# EAGLE schematic AniBike_v2.7_BT_MainBoard (EAGLE 5.08)

## Sheet 1 of 2
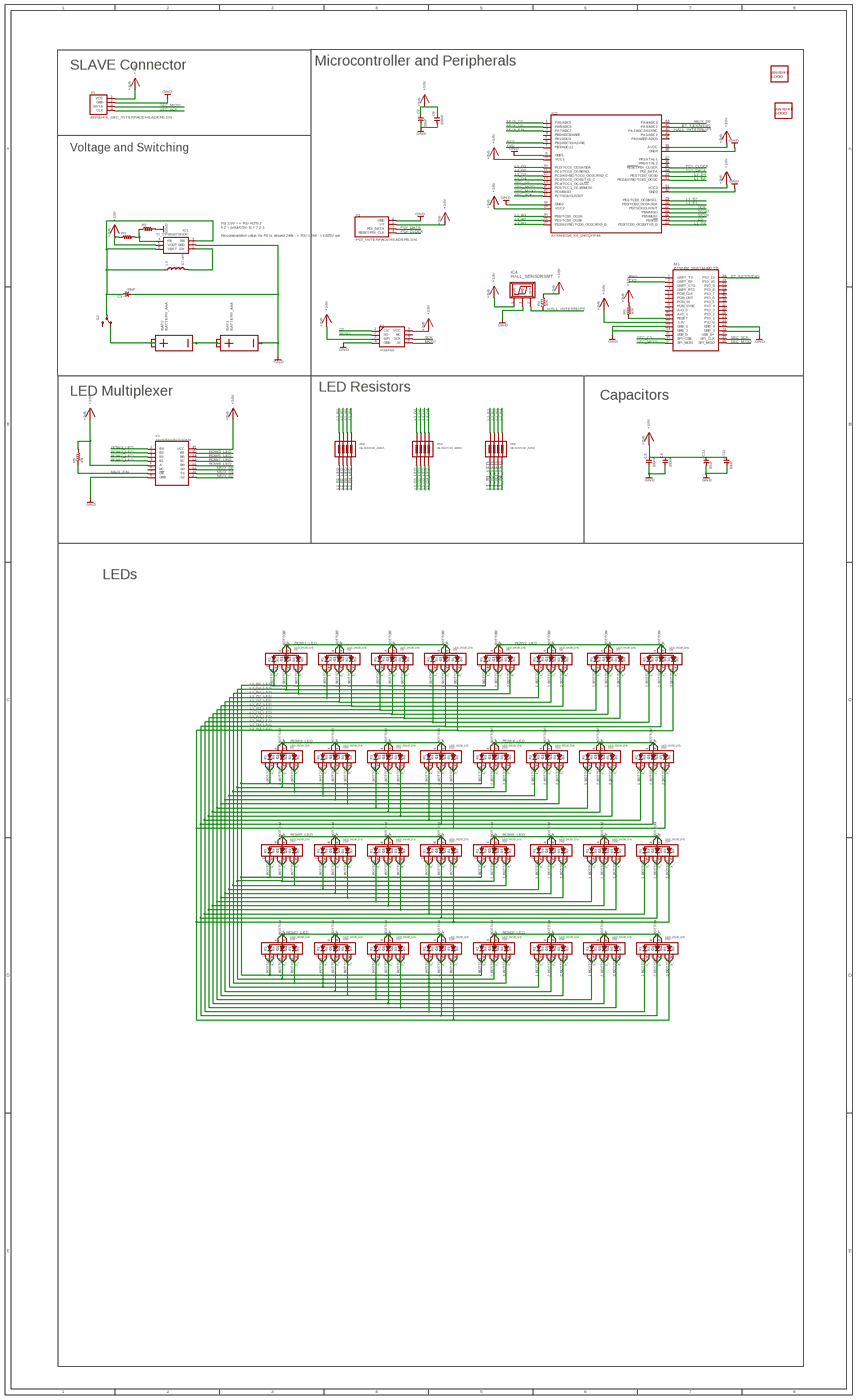
[diagram p0: schematic, sheet 1, overview]
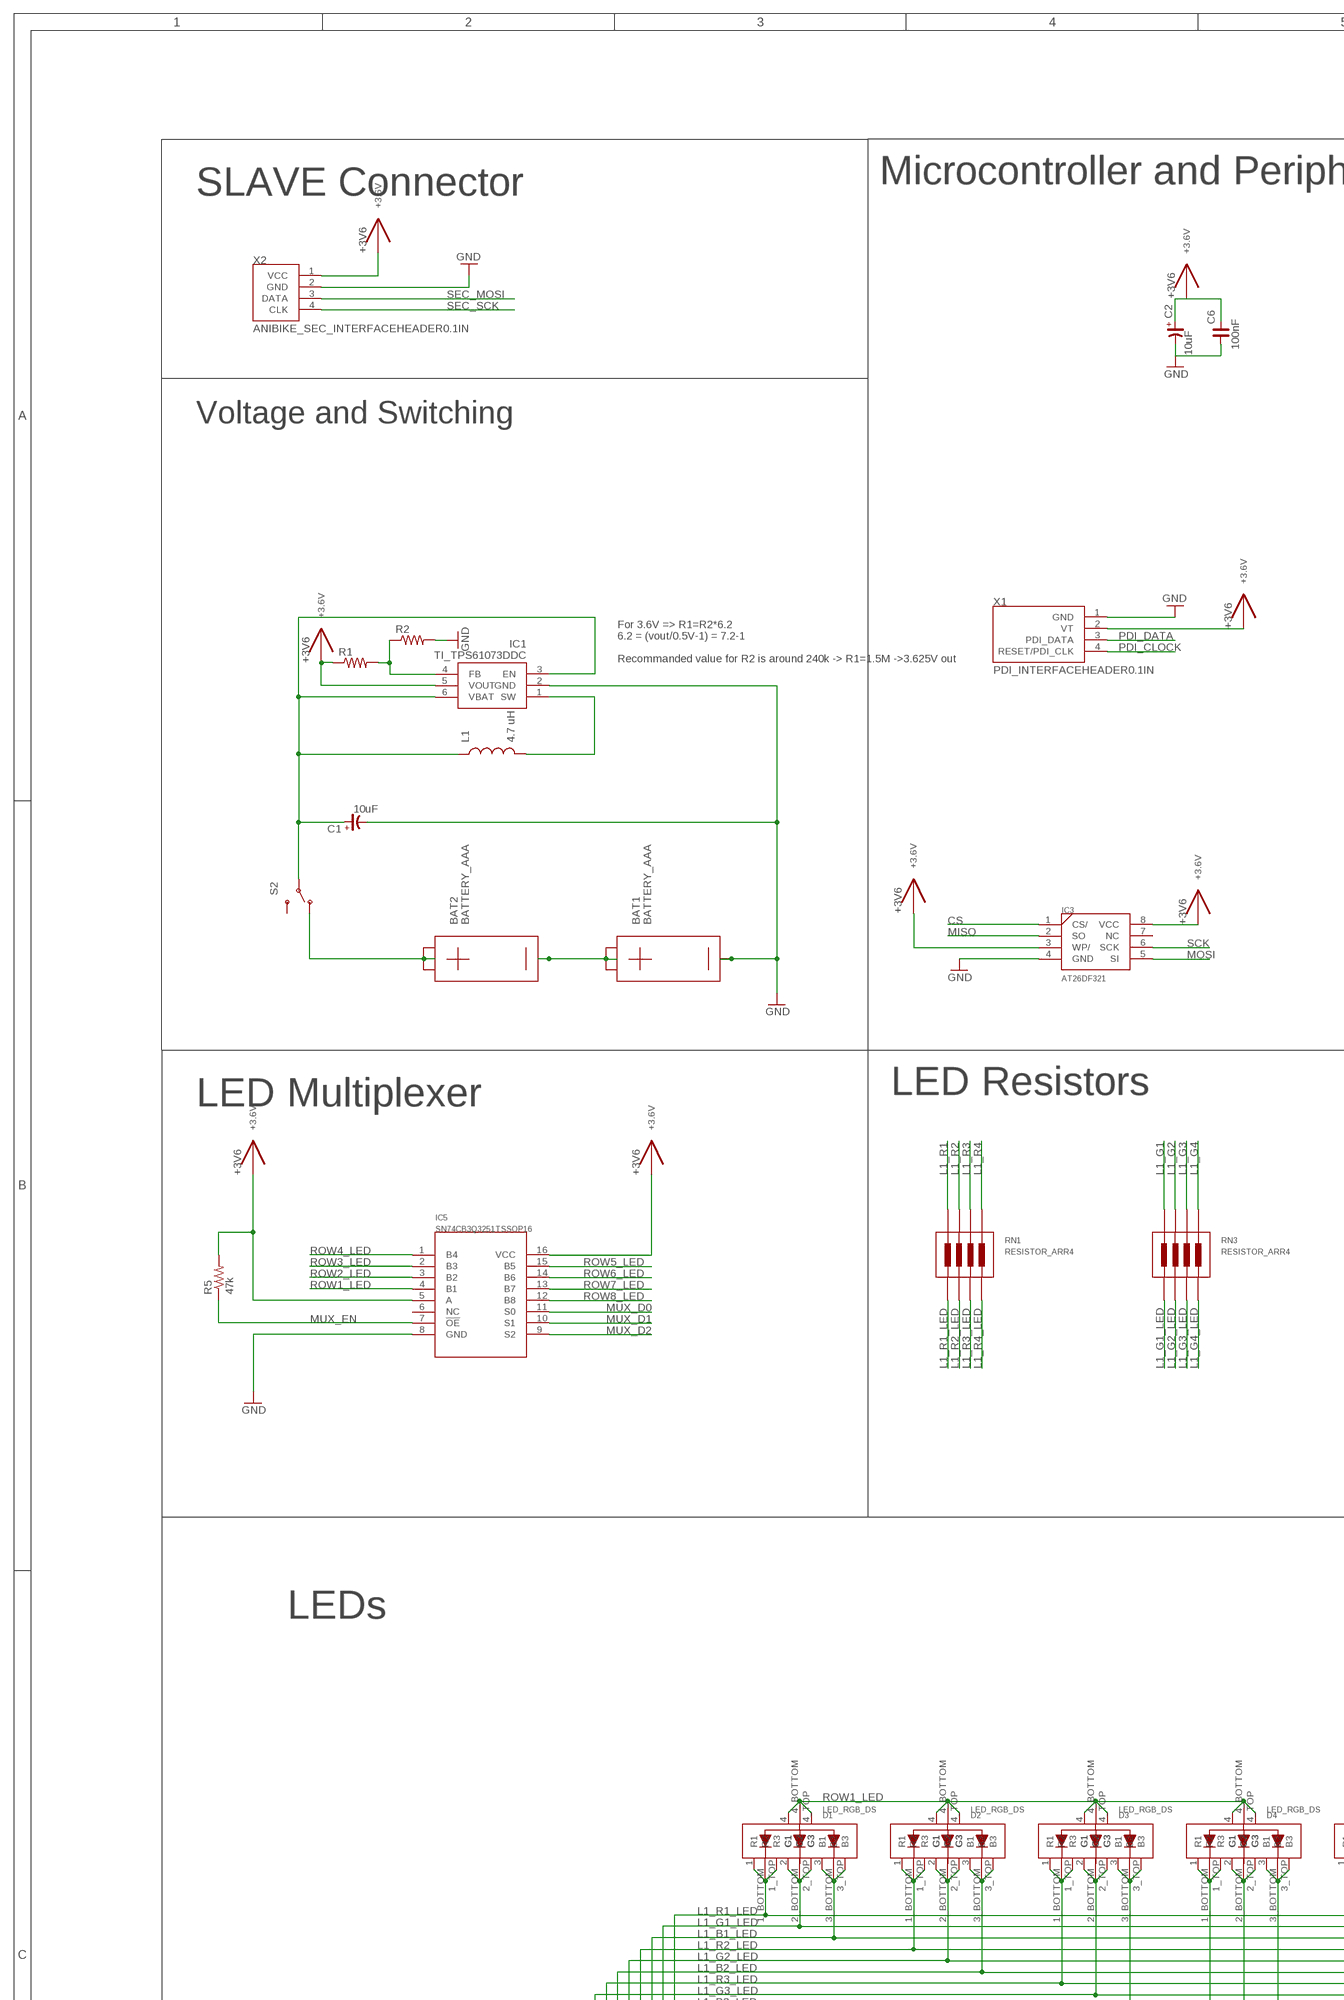
[diagram p1: schematic, sheet 1, part 1 of 4]
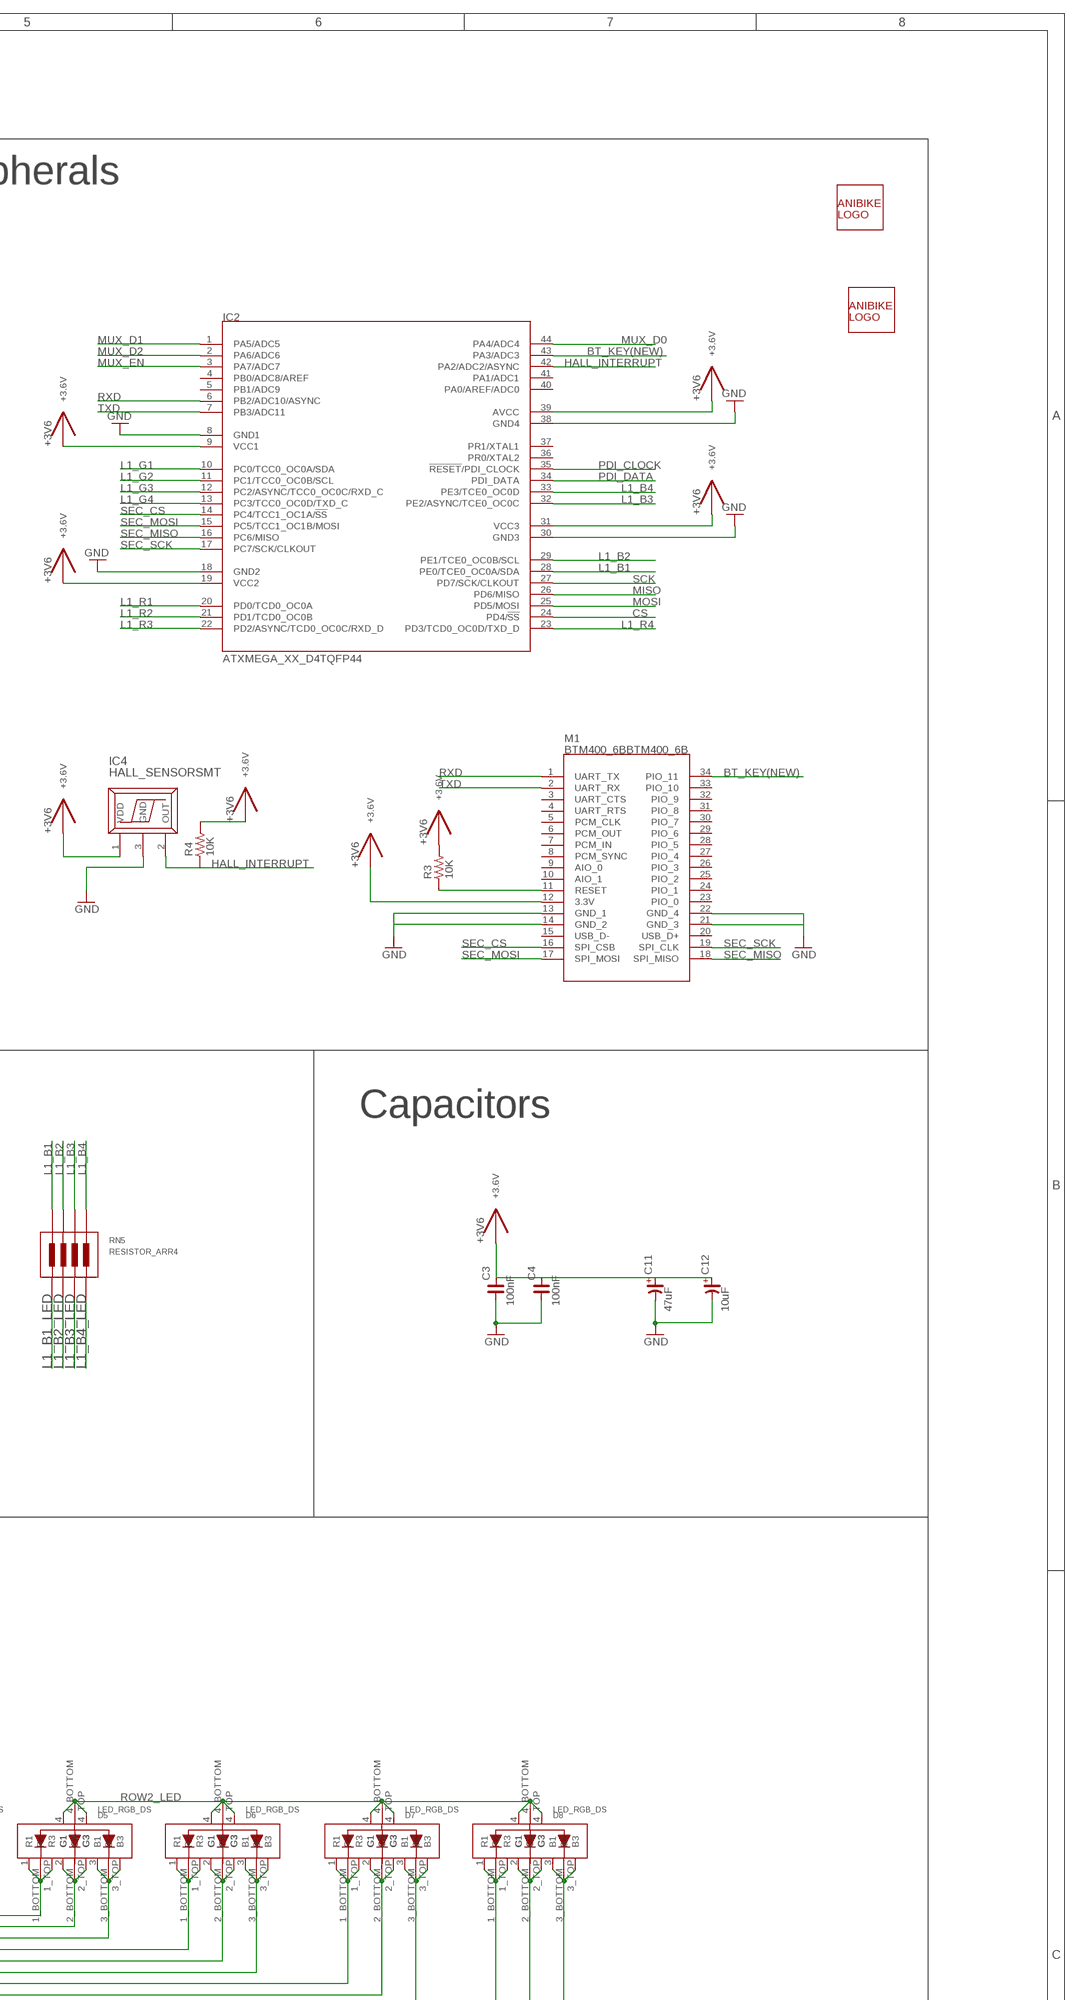
[diagram p2: schematic, sheet 1, part 2 of 4]
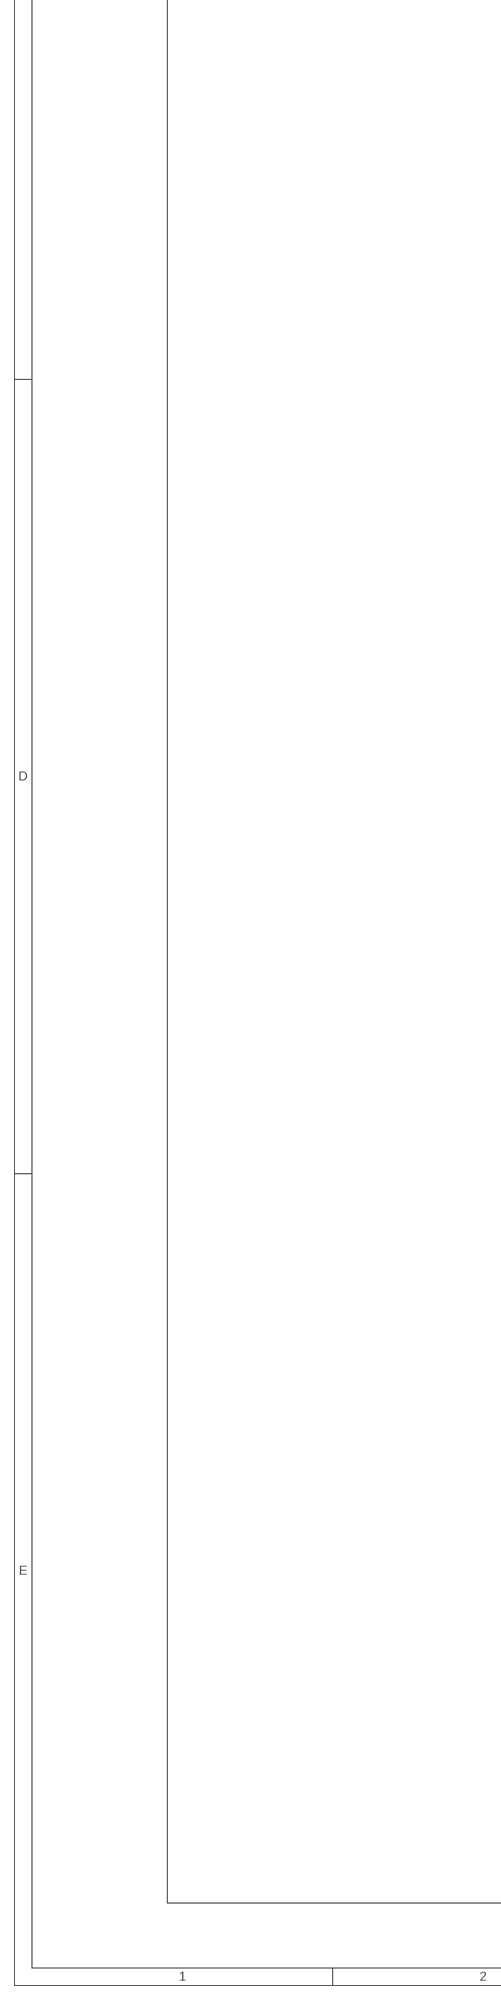
[diagram p3: schematic, sheet 1, part 3 of 4]
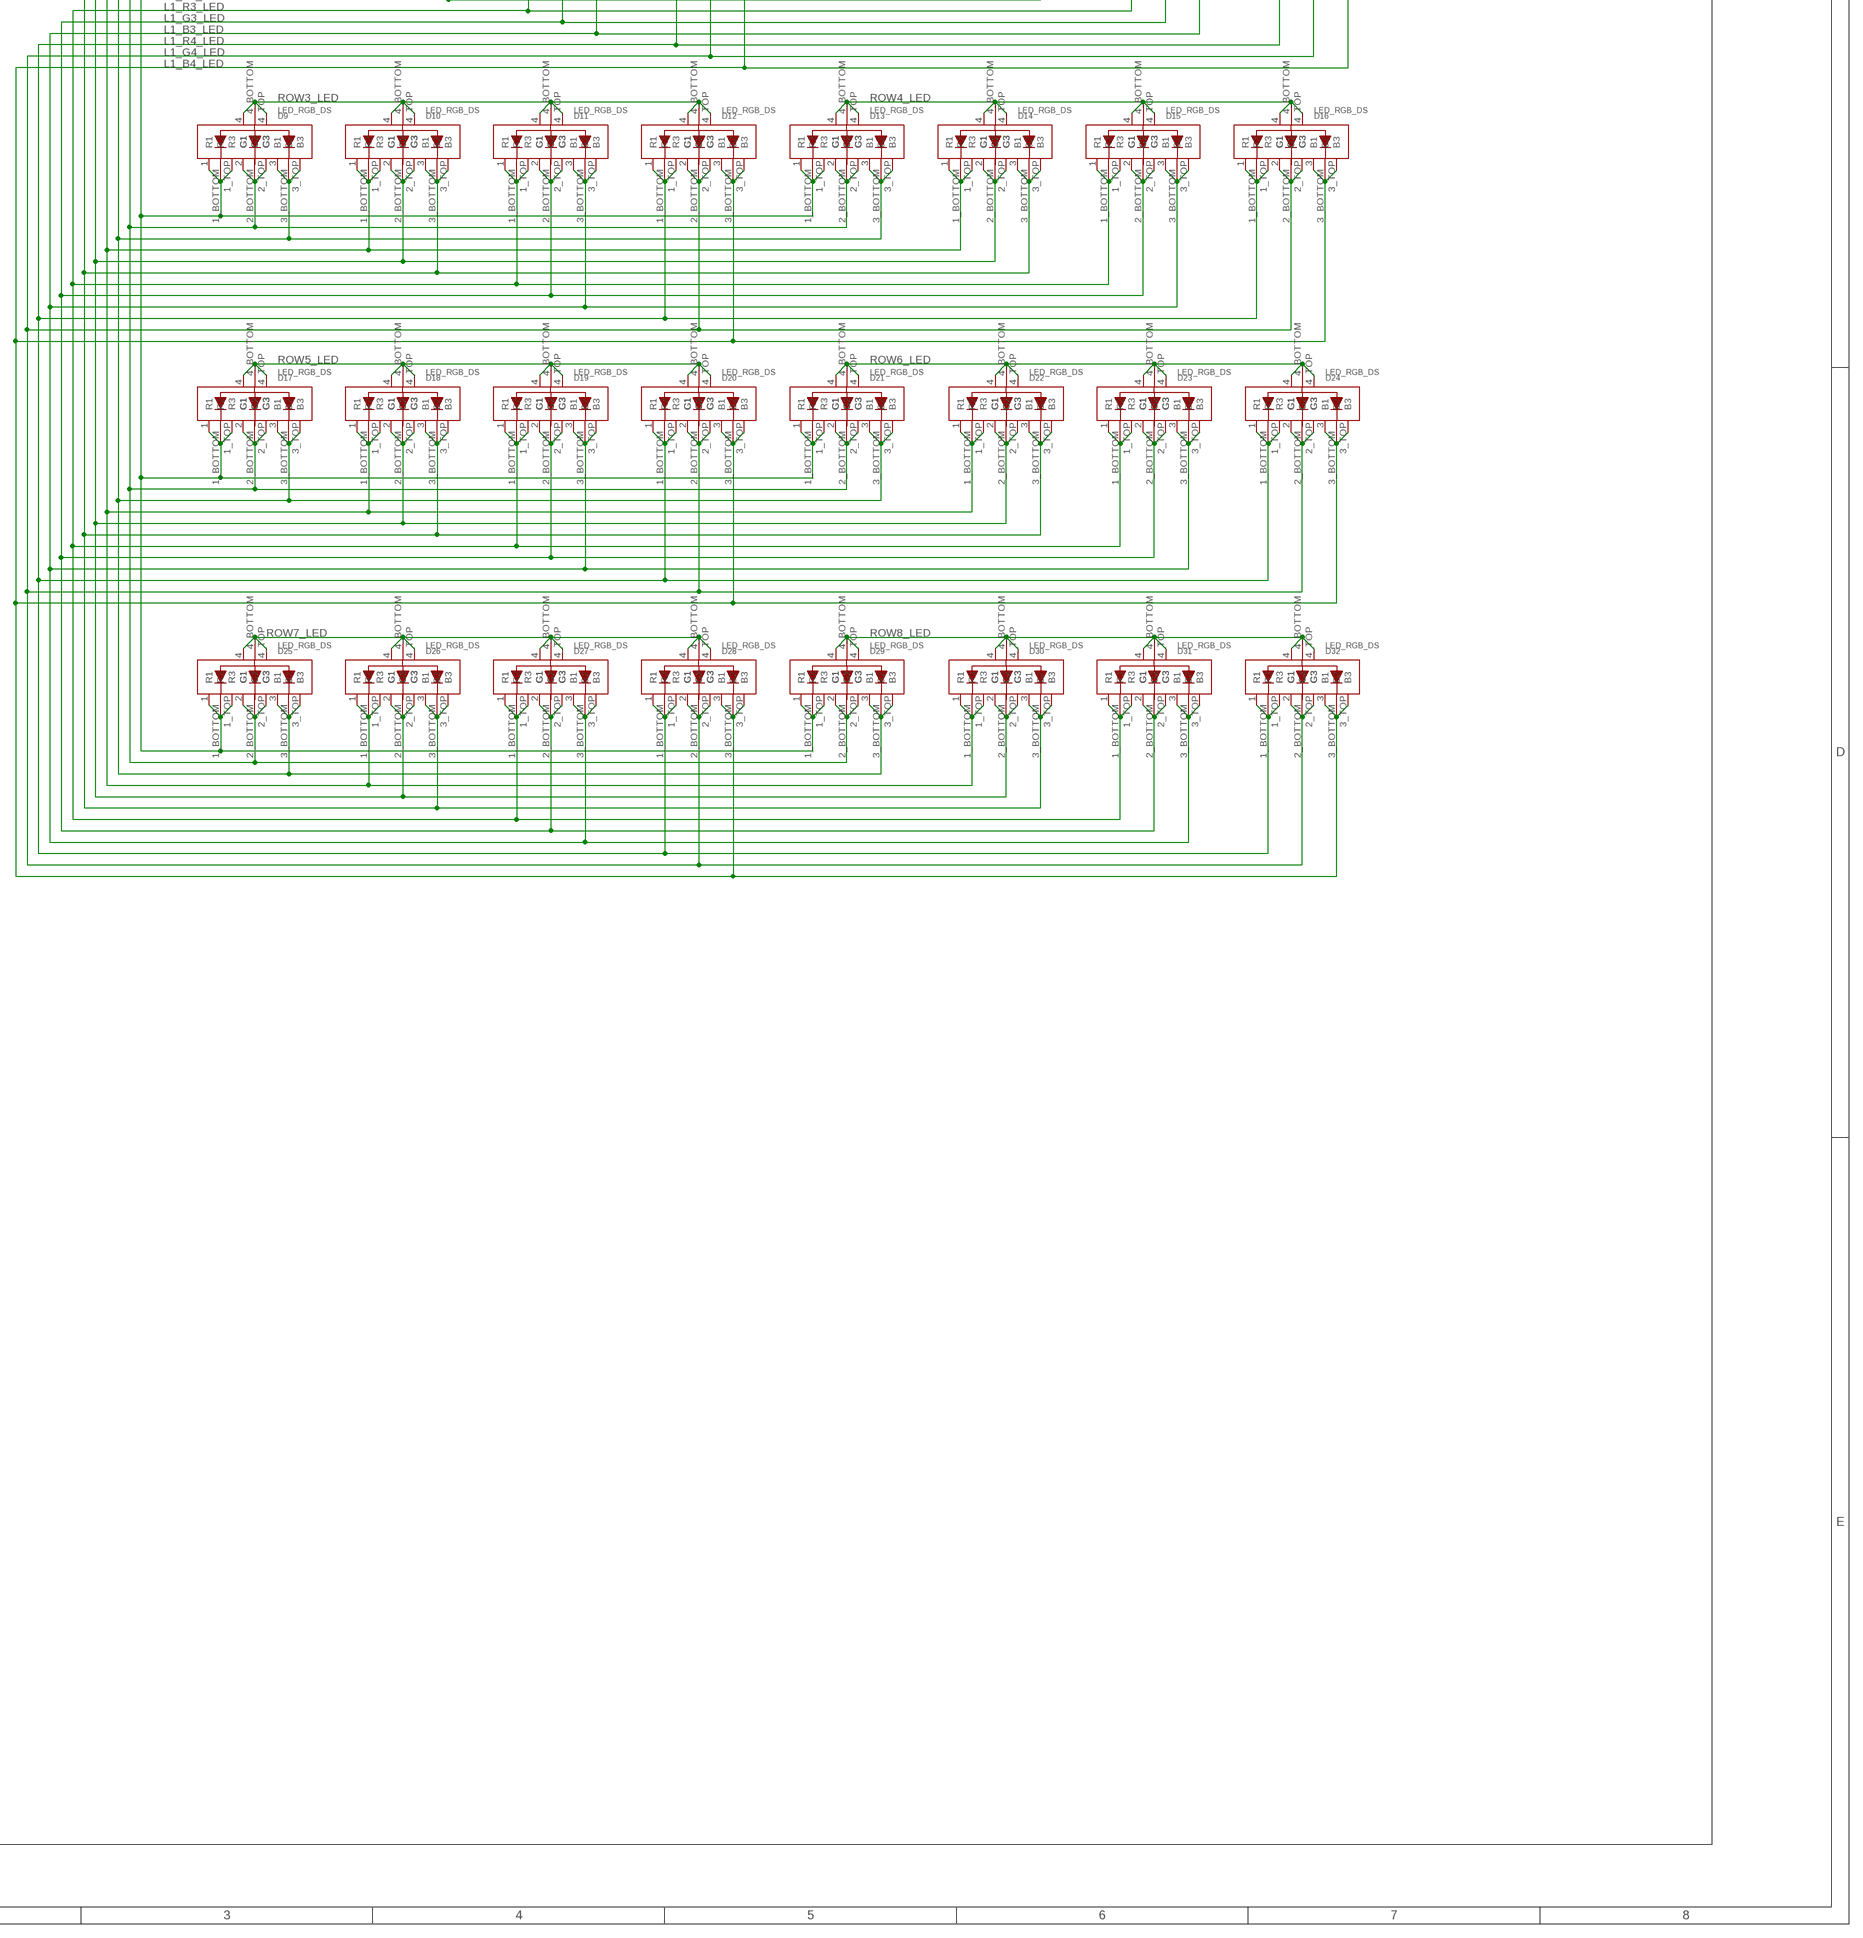
[diagram p4: schematic, sheet 1, part 4 of 4]

### Parts
BAT1  BATTERY_AAA  [BATTERY_AAA]
BAT2  BATTERY_AAA  [BATTERY_AAA]
C1  10uF  CP_3528-21  [C3528-21/T]
C2  10uF  CP_3528-21  [C3528-21/T]
C3  100nF  C_0805  [C0805]
C4  100nF  C_0805  [C0805]
C6  100nF  C_0805  [C0805]
C11  47uF  CP_3528-21  [C3528-21/T]
C12  10uF  CP_3528-21  [C3528-21/T]
D1  LED_RGB_DS  [LED1210_DS]
D2  LED_RGB_DS  [LED1210_DS]
D3  LED_RGB_DS  [LED1210_DS]
D4  LED_RGB_DS  [LED1210_DS]
D5  LED_RGB_DS  [LED1210_DS]
D6  LED_RGB_DS  [LED1210_DS]
D7  LED_RGB_DS  [LED1210_DS]
D8  LED_RGB_DS  [LED1210_DS]
D9  LED_RGB_DS  [LED1210_DS]
D10  LED_RGB_DS  [LED1210_DS]
D11  LED_RGB_DS  [LED1210_DS]
D12  LED_RGB_DS  [LED1210_DS]
D13  LED_RGB_DS  [LED1210_DS]
D14  LED_RGB_DS  [LED1210_DS]
D15  LED_RGB_DS  [LED1210_DS]
D16  LED_RGB_DS  [LED1210_DS]
D17  LED_RGB_DS  [LED1210_DS]
D18  LED_RGB_DS  [LED1210_DS]
D19  LED_RGB_DS  [LED1210_DS]
D20  LED_RGB_DS  [LED1210_DS]
D21  LED_RGB_DS  [LED1210_DS]
D22  LED_RGB_DS  [LED1210_DS]
D23  LED_RGB_DS  [LED1210_DS]
D24  LED_RGB_DS  [LED1210_DS]
D25  LED_RGB_DS  [LED1210_DS]
D26  LED_RGB_DS  [LED1210_DS]
D27  LED_RGB_DS  [LED1210_DS]
D28  LED_RGB_DS  [LED1210_DS]
D29  LED_RGB_DS  [LED1210_DS]
D30  LED_RGB_DS  [LED1210_DS]
D31  LED_RGB_DS  [LED1210_DS]
D32  LED_RGB_DS  [LED1210_DS]
IC1  TI_TPS61073DDC  [DDC]
IC2  ATXMEGA_XX_D4TQFP44  [TQFP44]
IC3  AT26DF321  [SOIC8]
IC4  HALL_SENSORSMT  [HALL_SENSOR_SE]
IC5  SN74CB3Q3251TSSOP16  [TSSOP16]
L1  4.7 uH  INDUCTOR1210  [1210]
M1  BTM400_6BBTM400_6B  [BTM400_6B]
R1  RESISTOR0603-RES  [0603-RES]
R2  RESISTOR0603-RES  [0603-RES]
R3  10K  R_0805  [R0805]
R4  10K  R_0805  [R0805]
R5  47k  RESISTOR0603-RES  [0603-RES]
RN1  RESISTOR_ARR4  [YCTC164]
RN3  RESISTOR_ARR4  [YCTC164]
RN5  RESISTOR_ARR4  [YCTC164]
S2  SWITCH-SPSTSMD2  [SWITCH-SPDT-SMD]
U$1  ANIBIKE_LOGOLOGO_3_MED  [ANIBIKE_LOGO_3_MEDIUM]
U$2  ANIBIKE_LOGOLOGO_6_BIG  [ANIBIKE_LOGO_6_BIG]
X1  PDI_INTERFACEHEADER0.1IN  [MOLEX-1X4_LOCK]
X2  ANIBIKE_SEC_INTERFACEHEADER0.1IN  [MOLEX-1X4_LOCK]

### Nets
+3.6V: C2.+ C3.2 C4.2 C6.2 C11.+ C12.+ IC1.5(VOUT) IC2.9(VCC1) IC2.19(VCC2) IC2.31(VCC3) IC2.39(AVCC) IC3.3(WP/) IC3.8(VCC) IC4.1(VDD) IC5.5(A) IC5.16(VCC) M1.12(3.3V) R1.1 R3.2 R4.2 R5.2 X1.2(VT) X2.1(VCC) ; supply symbol labelled +3V6
BT_KEY(NEW): IC2.43(PA3/ADC3) M1.34(PIO_11)
CS: IC2.24(PD4/!SS!) IC3.1(CS/)
GND: BAT1.MINUS1 BAT1.MINUS2 C1.- C2.- C3.1 C4.1 C6.1 C11.- C12.- IC1.2(GND) IC2.8(GND1) IC2.18(GND2) IC2.30(GND3) IC2.38(GND4) IC3.4(GND) IC4.3(GND) IC5.8(GND) M1.13(GND_1) M1.14(GND_2) M1.21(GND_3) M1.22(GND_4) R2.2 X1.1(GND) X2.2(GND)
HALL_INTERRUPT: IC2.42(PA2/ADC2/ASYNC) IC4.2(OUT) R4.1
L1_B1: IC2.28(PE0/TCE0_OC0A/SDA) RN5.P$8
L1_B1_LED: D1.3(B1) D1.3_BOTTOM(B2) D1.3_TOP(B3) D5.3(B1) D5.3_BOTTOM(B2) D5.3_TOP(B3) D9.3(B1) D9.3_BOTTOM(B2) D9.3_TOP(B3) D13.3(B1) D13.3_BOTTOM(B2) D13.3_TOP(B3) D17.3(B1) D17.3_BOTTOM(B2) D17.3_TOP(B3) D21.3(B1) D21.3_BOTTOM(B2) D21.3_TOP(B3) D25.3(B1) D25.3_BOTTOM(B2) D25.3_TOP(B3) D29.3(B1) D29.3_BOTTOM(B2) D29.3_TOP(B3) RN5.P$1
L1_B2: IC2.29(PE1/TCE0_OC0B/SCL) RN5.P$7
L1_B2_LED: D2.3(B1) D2.3_BOTTOM(B2) D2.3_TOP(B3) D6.3(B1) D6.3_BOTTOM(B2) D6.3_TOP(B3) D10.3(B1) D10.3_BOTTOM(B2) D10.3_TOP(B3) D14.3(B1) D14.3_BOTTOM(B2) D14.3_TOP(B3) D18.3(B1) D18.3_BOTTOM(B2) D18.3_TOP(B3) D22.3(B1) D22.3_BOTTOM(B2) D22.3_TOP(B3) D26.3(B1) D26.3_BOTTOM(B2) D26.3_TOP(B3) D30.3(B1) D30.3_BOTTOM(B2) D30.3_TOP(B3) RN5.P$2
L1_B3: IC2.32(PE2/ASYNC/TCE0_OC0C) RN5.P$6
L1_B3_LED: D3.3(B1) D3.3_BOTTOM(B2) D3.3_TOP(B3) D7.3(B1) D7.3_BOTTOM(B2) D7.3_TOP(B3) D11.3(B1) D11.3_BOTTOM(B2) D11.3_TOP(B3) D15.3(B1) D15.3_BOTTOM(B2) D15.3_TOP(B3) D19.3(B1) D19.3_BOTTOM(B2) D19.3_TOP(B3) D23.3(B1) D23.3_BOTTOM(B2) D23.3_TOP(B3) D27.3(B1) D27.3_BOTTOM(B2) D27.3_TOP(B3) D31.3(B1) D31.3_BOTTOM(B2) D31.3_TOP(B3) RN5.P$3
L1_B4: IC2.33(PE3/TCE0_OC0D) RN5.P$5
L1_B4_LED: D4.3(B1) D4.3_BOTTOM(B2) D4.3_TOP(B3) D8.3(B1) D8.3_BOTTOM(B2) D8.3_TOP(B3) D12.3(B1) D12.3_BOTTOM(B2) D12.3_TOP(B3) D16.3(B1) D16.3_BOTTOM(B2) D16.3_TOP(B3) D20.3(B1) D20.3_BOTTOM(B2) D20.3_TOP(B3) D24.3(B1) D24.3_BOTTOM(B2) D24.3_TOP(B3) D28.3(B1) D28.3_BOTTOM(B2) D28.3_TOP(B3) D32.3(B1) D32.3_BOTTOM(B2) D32.3_TOP(B3) RN5.P$4
L1_G1: IC2.10(PC0/TCC0_OC0A/SDA) RN3.P$8
L1_G1_LED: D1.2(G1) D1.2_BOTTOM(G2) D1.2_TOP(G3) D5.2(G1) D5.2_BOTTOM(G2) D5.2_TOP(G3) D9.2(G1) D9.2_BOTTOM(G2) D9.2_TOP(G3) D13.2(G1) D13.2_BOTTOM(G2) D13.2_TOP(G3) D17.2(G1) D17.2_BOTTOM(G2) D17.2_TOP(G3) D21.2(G1) D21.2_BOTTOM(G2) D21.2_TOP(G3) D25.2(G1) D25.2_BOTTOM(G2) D25.2_TOP(G3) D29.2(G1) D29.2_BOTTOM(G2) D29.2_TOP(G3) RN3.P$1
L1_G2: IC2.11(PC1/TCC0_OC0B/SCL) RN3.P$7
L1_G2_LED: D2.2(G1) D2.2_BOTTOM(G2) D2.2_TOP(G3) D6.2(G1) D6.2_BOTTOM(G2) D6.2_TOP(G3) D10.2(G1) D10.2_BOTTOM(G2) D10.2_TOP(G3) D14.2(G1) D14.2_BOTTOM(G2) D14.2_TOP(G3) D18.2(G1) D18.2_BOTTOM(G2) D18.2_TOP(G3) D22.2(G1) D22.2_BOTTOM(G2) D22.2_TOP(G3) D26.2(G1) D26.2_BOTTOM(G2) D26.2_TOP(G3) D30.2(G1) D30.2_BOTTOM(G2) D30.2_TOP(G3) RN3.P$2
L1_G3: IC2.12(PC2/ASYNC/TCC0_OC0C/RXD_C) RN3.P$6
L1_G3_LED: D3.2(G1) D3.2_BOTTOM(G2) D3.2_TOP(G3) D7.2(G1) D7.2_BOTTOM(G2) D7.2_TOP(G3) D11.2(G1) D11.2_BOTTOM(G2) D11.2_TOP(G3) D15.2(G1) D15.2_BOTTOM(G2) D15.2_TOP(G3) D19.2(G1) D19.2_BOTTOM(G2) D19.2_TOP(G3) D23.2(G1) D23.2_BOTTOM(G2) D23.2_TOP(G3) D27.2(G1) D27.2_BOTTOM(G2) D27.2_TOP(G3) D31.2(G1) D31.2_BOTTOM(G2) D31.2_TOP(G3) RN3.P$3
L1_G4: IC2.13(PC3/TCC0_OC0D/TXD_C) RN3.P$5
L1_G4_LED: D4.2(G1) D4.2_BOTTOM(G2) D4.2_TOP(G3) D8.2(G1) D8.2_BOTTOM(G2) D8.2_TOP(G3) D12.2(G1) D12.2_BOTTOM(G2) D12.2_TOP(G3) D16.2(G1) D16.2_BOTTOM(G2) D16.2_TOP(G3) D20.2(G1) D20.2_BOTTOM(G2) D20.2_TOP(G3) D24.2(G1) D24.2_BOTTOM(G2) D24.2_TOP(G3) D28.2(G1) D28.2_BOTTOM(G2) D28.2_TOP(G3) D32.2(G1) D32.2_BOTTOM(G2) D32.2_TOP(G3) RN3.P$4
L1_R1: IC2.20(PD0/TCD0_OC0A) RN1.P$8
L1_R1_LED: D1.1(R1) D1.1_BOTTOM(R2) D1.1_TOP(R3) D5.1(R1) D5.1_BOTTOM(R2) D5.1_TOP(R3) D9.1(R1) D9.1_BOTTOM(R2) D9.1_TOP(R3) D13.1(R1) D13.1_BOTTOM(R2) D13.1_TOP(R3) D17.1(R1) D17.1_BOTTOM(R2) D17.1_TOP(R3) D21.1(R1) D21.1_BOTTOM(R2) D21.1_TOP(R3) D25.1(R1) D25.1_BOTTOM(R2) D25.1_TOP(R3) D29.1(R1) D29.1_BOTTOM(R2) D29.1_TOP(R3) RN1.P$1
L1_R2: IC2.21(PD1/TCD0_OC0B) RN1.P$7
L1_R2_LED: D2.1(R1) D2.1_BOTTOM(R2) D2.1_TOP(R3) D6.1(R1) D6.1_BOTTOM(R2) D6.1_TOP(R3) D10.1(R1) D10.1_BOTTOM(R2) D10.1_TOP(R3) D14.1(R1) D14.1_BOTTOM(R2) D14.1_TOP(R3) D18.1(R1) D18.1_BOTTOM(R2) D18.1_TOP(R3) D22.1(R1) D22.1_BOTTOM(R2) D22.1_TOP(R3) D26.1(R1) D26.1_BOTTOM(R2) D26.1_TOP(R3) D30.1(R1) D30.1_BOTTOM(R2) D30.1_TOP(R3) RN1.P$2
L1_R3: IC2.22(PD2/ASYNC/TCD0_OC0C/RXD_D) RN1.P$6
L1_R3_LED: D3.1(R1) D3.1_BOTTOM(R2) D3.1_TOP(R3) D7.1(R1) D7.1_BOTTOM(R2) D7.1_TOP(R3) D11.1(R1) D11.1_BOTTOM(R2) D11.1_TOP(R3) D15.1(R1) D15.1_BOTTOM(R2) D15.1_TOP(R3) D19.1(R1) D19.1_BOTTOM(R2) D19.1_TOP(R3) D23.1(R1) D23.1_BOTTOM(R2) D23.1_TOP(R3) D27.1(R1) D27.1_BOTTOM(R2) D27.1_TOP(R3) D31.1(R1) D31.1_BOTTOM(R2) D31.1_TOP(R3) RN1.P$3
L1_R4: IC2.23(PD3/TCD0_OC0D/TXD_D) RN1.P$5
L1_R4_LED: D4.1(R1) D4.1_BOTTOM(R2) D4.1_TOP(R3) D8.1(R1) D8.1_BOTTOM(R2) D8.1_TOP(R3) D12.1(R1) D12.1_BOTTOM(R2) D12.1_TOP(R3) D16.1(R1) D16.1_BOTTOM(R2) D16.1_TOP(R3) D20.1(R1) D20.1_BOTTOM(R2) D20.1_TOP(R3) D24.1(R1) D24.1_BOTTOM(R2) D24.1_TOP(R3) D28.1(R1) D28.1_BOTTOM(R2) D28.1_TOP(R3) D32.1(R1) D32.1_BOTTOM(R2) D32.1_TOP(R3) RN1.P$4
MISO: IC2.26(PD6/MISO) IC3.2(SO)
MOSI: IC2.25(PD5/MOSI) IC3.5(SI)
MUX_D0: IC2.44(PA4/ADC4) IC5.11(S0)
MUX_D1: IC2.1(PA5/ADC5) IC5.10(S1)
MUX_D2: IC2.2(PA6/ADC6) IC5.9(S2)
MUX_EN: IC2.3(PA7/ADC7) IC5.7(!OE!) R5.1
N$1: IC1.1(SW) L1.2
N$2: C1.+ IC1.3(EN) IC1.6(VBAT) L1.1 S2.2(P)
N$4: BAT1.PLUS1 BAT1.PLUS2 BAT2.MINUS1 BAT2.MINUS2
N$5: BAT2.PLUS1 BAT2.PLUS2 S2.1(O)
N$6: IC1.4(FB) R1.2 R2.1
N$8: M1.11(RESET) R3.1
PDI_CLOCK: IC2.35(!RESET!/PDI_CLOCK) X1.4(RESET/PDI_CLK)
PDI_DATA: IC2.34(PDI_DATA) X1.3(PDI_DATA)
ROW1_LED: D1.4(C1) D1.4_BOTTOM(C2) D1.4_TOP(C3) D2.4(C1) D2.4_BOTTOM(C2) D2.4_TOP(C3) D3.4(C1) D3.4_BOTTOM(C2) D3.4_TOP(C3) D4.4(C1) D4.4_BOTTOM(C2) D4.4_TOP(C3) IC5.4(B1)
ROW2_LED: D5.4(C1) D5.4_BOTTOM(C2) D5.4_TOP(C3) D6.4(C1) D6.4_BOTTOM(C2) D6.4_TOP(C3) D7.4(C1) D7.4_BOTTOM(C2) D7.4_TOP(C3) D8.4(C1) D8.4_BOTTOM(C2) D8.4_TOP(C3) IC5.3(B2)
ROW3_LED: D9.4(C1) D9.4_BOTTOM(C2) D9.4_TOP(C3) D10.4(C1) D10.4_BOTTOM(C2) D10.4_TOP(C3) D11.4(C1) D11.4_BOTTOM(C2) D11.4_TOP(C3) D12.4(C1) D12.4_BOTTOM(C2) D12.4_TOP(C3) IC5.2(B3)
ROW4_LED: D13.4(C1) D13.4_BOTTOM(C2) D13.4_TOP(C3) D14.4(C1) D14.4_BOTTOM(C2) D14.4_TOP(C3) D15.4(C1) D15.4_BOTTOM(C2) D15.4_TOP(C3) D16.4(C1) D16.4_BOTTOM(C2) D16.4_TOP(C3) IC5.1(B4)
ROW5_LED: D17.4(C1) D17.4_BOTTOM(C2) D17.4_TOP(C3) D18.4(C1) D18.4_BOTTOM(C2) D18.4_TOP(C3) D19.4(C1) D19.4_BOTTOM(C2) D19.4_TOP(C3) D20.4(C1) D20.4_BOTTOM(C2) D20.4_TOP(C3) IC5.15(B5)
ROW6_LED: D21.4(C1) D21.4_BOTTOM(C2) D21.4_TOP(C3) D22.4(C1) D22.4_BOTTOM(C2) D22.4_TOP(C3) D23.4(C1) D23.4_BOTTOM(C2) D23.4_TOP(C3) D24.4(C1) D24.4_BOTTOM(C2) D24.4_TOP(C3) IC5.14(B6)
ROW7_LED: D25.4(C1) D25.4_BOTTOM(C2) D25.4_TOP(C3) D26.4(C1) D26.4_BOTTOM(C2) D26.4_TOP(C3) D27.4(C1) D27.4_BOTTOM(C2) D27.4_TOP(C3) D28.4(C1) D28.4_BOTTOM(C2) D28.4_TOP(C3) IC5.13(B7)
ROW8_LED: D29.4(C1) D29.4_BOTTOM(C2) D29.4_TOP(C3) D30.4(C1) D30.4_BOTTOM(C2) D30.4_TOP(C3) D31.4(C1) D31.4_BOTTOM(C2) D31.4_TOP(C3) D32.4(C1) D32.4_BOTTOM(C2) D32.4_TOP(C3) IC5.12(B8)
RXD: IC2.6(PB2/ADC10/ASYNC) M1.1(UART_TX)
SCK: IC2.27(PD7/SCK/CLKOUT) IC3.6(SCK)
SEC_CS: IC2.14(PC4/TCC1_OC1A/!SS!) M1.16(SPI_CSB)
SEC_MISO: IC2.16(PC6/MISO) M1.18(SPI_MISO)
SEC_MOSI: IC2.15(PC5/TCC1_OC1B/MOSI) M1.17(SPI_MOSI) X2.3(DATA)
SEC_SCK: IC2.17(PC7/SCK/CLKOUT) M1.19(SPI_CLK) X2.4(CLK)
TXD: IC2.7(PB3/ADC11) M1.2(UART_RX)
Unconnected: IC2.4(PB0/ADC8/AREF) IC2.5(PB1/ADC9) IC2.36(PR0/XTAL2) IC2.37(PR1/XTAL1) IC2.40(PA0/AREF/ADC0) IC2.41(PA1/ADC1) IC3.7(NC) IC5.6(NC) M1.3(UART_CTS) M1.4(UART_RTS) M1.5(PCM_CLK) M1.6(PCM_OUT) M1.7(PCM_IN) M1.8(PCM_SYNC) M1.9(AIO_0) M1.10(AIO_1) M1.15(USB_D-) M1.20(USB_D+) M1.23(PIO_0) M1.24(PIO_1) M1.25(PIO_2) M1.26(PIO_3) M1.27(PIO_4) M1.28(PIO_5) M1.29(PIO_6) M1.30(PIO_7) M1.31(PIO_8) M1.32(PIO_9) M1.33(PIO_10) S2.3(S)

### Notes on the sheet
- SLAVE Connector | Microcontroller and Peripherals
- Voltage and Switching
- For 3.6V => R1=R2*6.2
- 6.2 = (vout/0.5V-1) = 7.2-1
- Recommanded value for R2 is around 240k -> R1=1.5M ->3.625V out
- LED Multiplexer | LED Resistors
- Capacitors
- LEDs

## Sheet 2 of 2

## Library data of the parts
BAT1 BAT2 = AniBike_Common_Library:BATTERY_AAA
C1 C11 C12 = AniBike_Common_Library:CP_: POLARIZED CAP
C2 = AniBike_v3.0_Library:CP_: POLARIZED CAP
C3 C6 = AniBike_Common_Library:C_: NON-POLARIZED CAP
C4 = AniBike_v3.0_Library:C_: NON-POLARIZED CAP
D1-D32 = AniBike_Common_Library:LED_RGB_DS
IC1 = AniBike_Common_Library:TI_TPS61073
IC2 = AniBike_Common_Library:ATXMEGA_XX_D4
IC3 = AniBike_v3.0_Library:AT26DF321
IC4 = AniBike_Common_Library:HALL_SENSOR
IC5 = AniBike_Common_Library:SN74CB3Q3251
L1 = SparkFun:INDUCTOR: Inductors Basic Inductor/Choke - 0603 and 1206. Footprints are not proven and vary greatly between part numbers.
M1 = AniBike_Common_Library:BTM400_6B
R1 R2 R5 = SparkFun:RESISTOR: Resistor Basic schematic elements and footprints for 0603, 1206, and PTH 1/10th watt (small) resistors.
R3 R4 = AniBike_v3.0_Library:R_: RESISTOR
RN1 RN3 RN5 = AniBike_Common_Library:RESISTOR_ARR4
S2 = SparkFun:SWITCH-SPST: SPST Switch Simple slide switch. Spark Fun Electronics SKU : COM-00102
U$1 U$2 = AniBike_Common_Library:ANIBIKE_LOGO
X1 = AniBike_Common_Library:PDI_INTERFACE
X2 = AniBike_Common_Library:ANIBIKE_SEC_INTERFACE